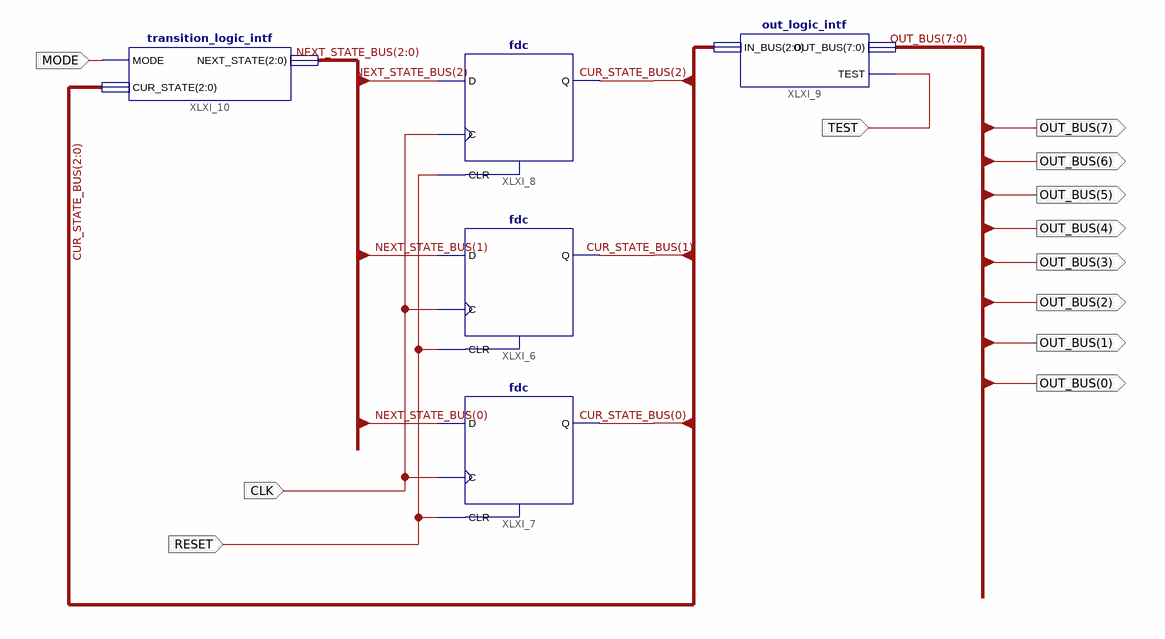
[diagram p0: schematic sheet 1]
// Xilinx ISE schematic LightController.sch (spartan3a) as structural Verilog: 5 symbols, 12 ports
module LightController (
  input  MODE,
  input  CLK,
  input  RESET,
  input  TEST,
  output [7:0] OUT_BUS
);

  wire [2:0] CUR_STATE_BUS, NEXT_STATE_BUS;

  fdc XLXI_6 (.C(CLK), .CLR(RESET), .D(NEXT_STATE_BUS[1]), .Q(CUR_STATE_BUS[1]));
  fdc XLXI_7 (.C(CLK), .CLR(RESET), .D(NEXT_STATE_BUS[0]), .Q(CUR_STATE_BUS[0]));
  fdc XLXI_8 (.C(CLK), .CLR(RESET), .D(NEXT_STATE_BUS[2]), .Q(CUR_STATE_BUS[2]));
  out_logic_intf XLXI_9 (.TEST(TEST), .IN_BUS(CUR_STATE_BUS), .OUT_BUS(OUT_BUS));
  transition_logic_intf XLXI_10 (.MODE(MODE), .CUR_STATE(CUR_STATE_BUS), .NEXT_STATE(NEXT_STATE_BUS));
endmodule
